# EAGLE design Yun_Shield.v1.1.6 (EAGLE 7.3.0)

## Sheet 1 of 5
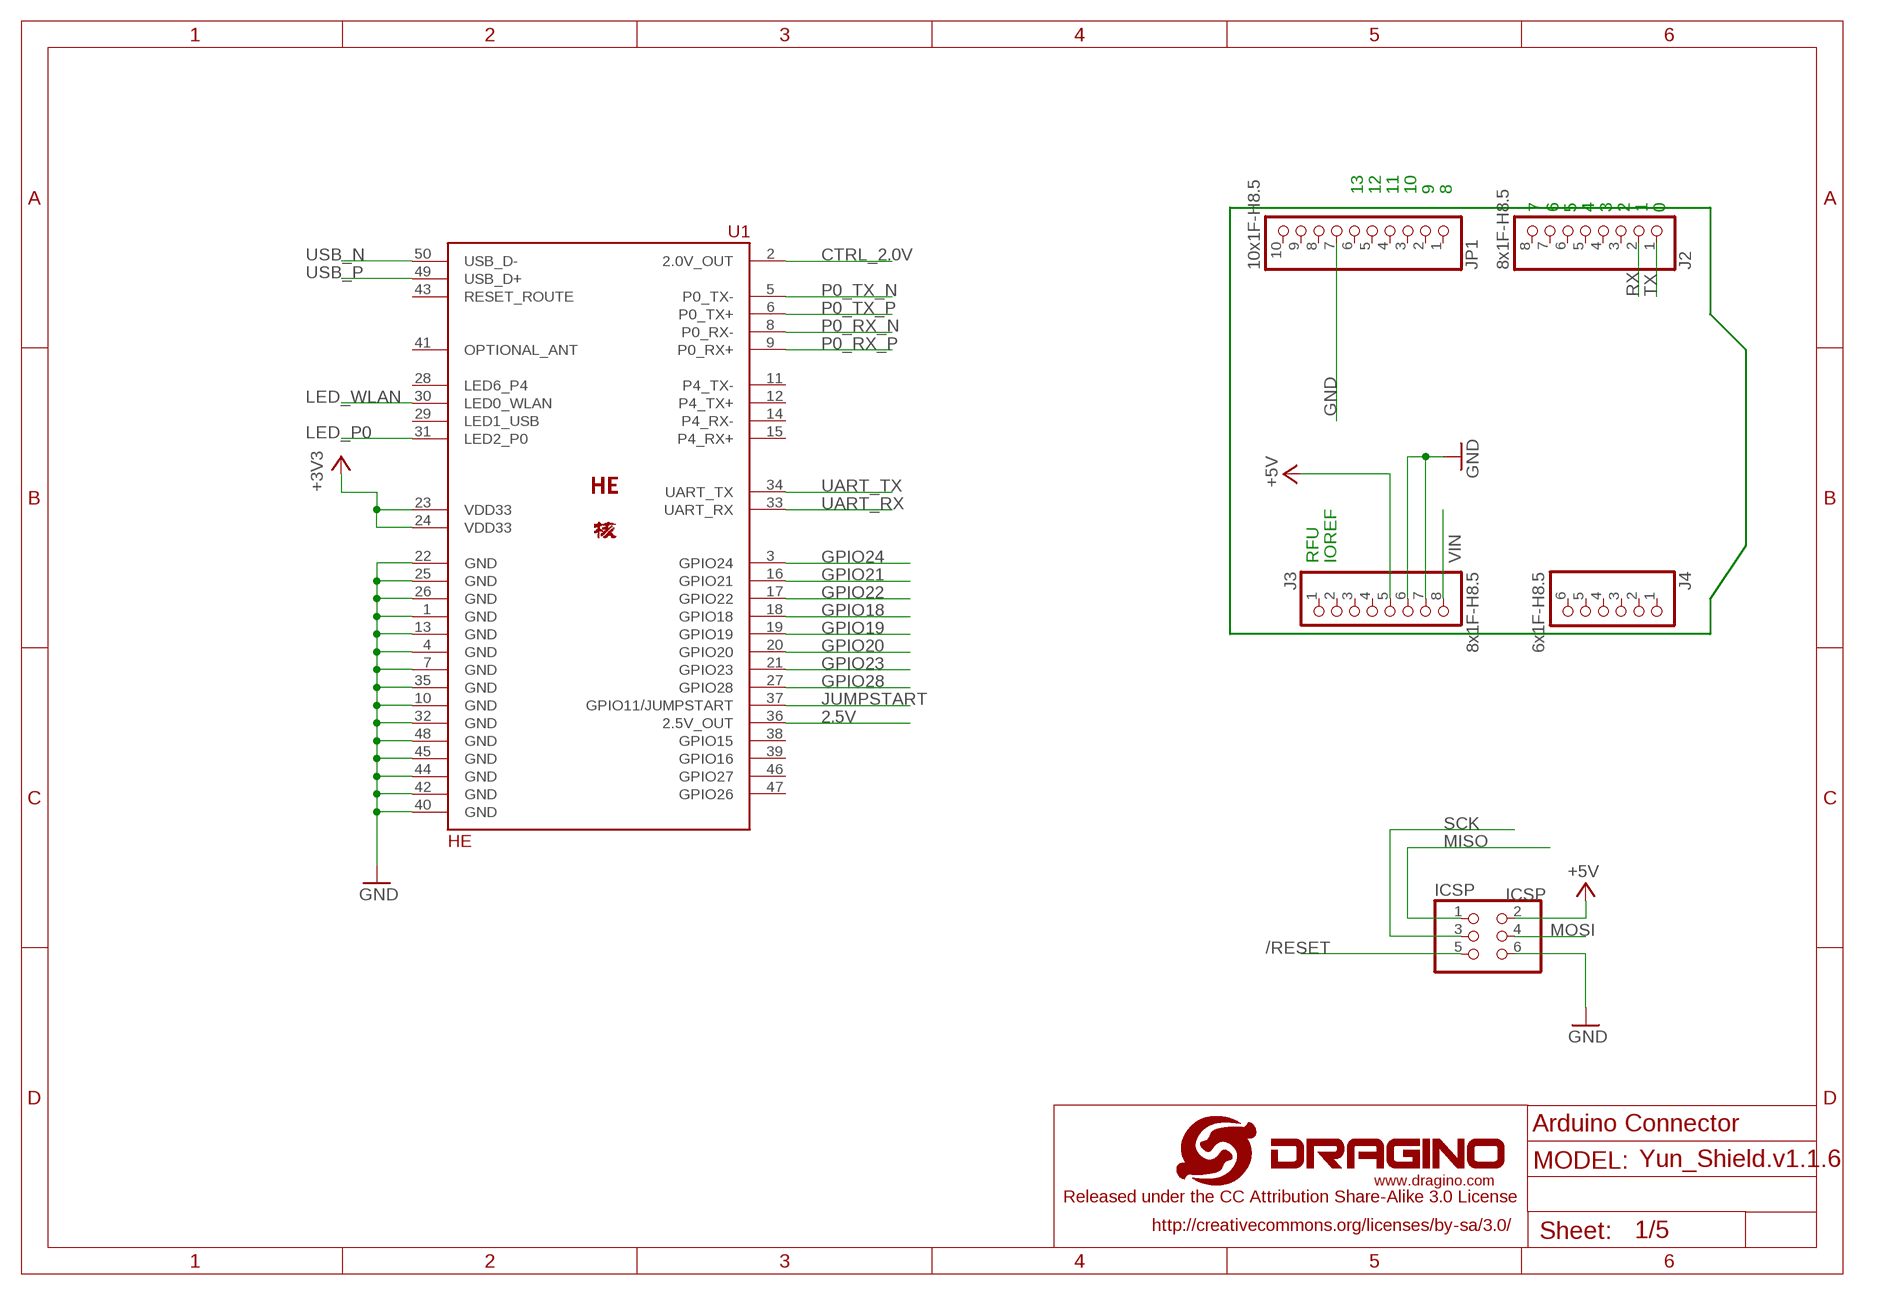
[diagram p0: schematic, sheet 1]

### Parts
ICSP  ICSP  PINHD-2X3  [2X03]
J2  8x1F-H8.5  PINHD-1X8  [1X08]
J3  8x1F-H8.5  PINHD-1X8  [1X08]
J4  6x1F-H8.5  PINHD-1X6  [1X06]
JP1  10x1F-H8.5  PINHD-1X10  [1X10]
U1  HE  [HE50]
U$1  LOGO-NEW  [LOGO-SILK-NEW]

### Nets
2.5V: U1.36(2.5V_OUT)
5V [usbvcc]: ICSP.2 ; supply symbol labelled +5V
+3V3: U1.23(VDD33) U1.24(VDD33) ; also sheet 2,3,4
+5V [usbvcc]: J3.5 ; also sheet 2,4
/RESET: ICSP.5 ; also sheet 3
CTRL_2.0V: U1.2(2.0V_OUT) ; also sheet 5
GND [gnd]: ICSP.6 J3.6 J3.7 JP1.7 U1.1(GND) U1.4(GND) U1.7(GND) U1.10(GND) U1.13(GND) U1.22(GND) U1.25(GND) U1.26(GND) U1.32(GND) U1.35(GND) U1.40(GND) U1.42(GND) U1.44(GND) U1.45(GND) U1.48(GND) ; also sheet 2,3,4,5
GPIO18: U1.18(GPIO18) ; also sheet 3
GPIO19: U1.19(GPIO19) ; also sheet 3
GPIO20: U1.20(GPIO20) ; also sheet 3
GPIO21: U1.16(GPIO21) ; also sheet 3
GPIO22: U1.17(GPIO22) ; also sheet 3
GPIO23: U1.21(GPIO23) ; also sheet 3
GPIO24: U1.3(GPIO24) ; also sheet 3
GPIO28: U1.27(GPIO28) ; also sheet 4
JUMPSTART: U1.37(GPIO11/JUMPSTART) ; also sheet 4
LED_P0: U1.31(LED2_P0) ; also sheet 4
LED_WLAN: U1.30(LED0_WLAN) ; also sheet 4
MISO: ICSP.1 ; also sheet 3
MOSI: ICSP.4 ; also sheet 3
P0_RX_N: U1.8(P0_RX-) ; also sheet 5
P0_RX_P: U1.9(P0_RX+) ; also sheet 5
P0_TX_N: U1.5(P0_TX-) ; also sheet 5
P0_TX_P: U1.6(P0_TX+) ; also sheet 5
RX: J2.2 ; also sheet 3
SCK: ICSP.3 ; also sheet 3
TX: J2.1 ; also sheet 3
UART_RX: U1.33(UART_RX) ; also sheet 3
UART_TX: U1.34(UART_TX) ; also sheet 3
USB_N [usbtrace]: U1.50(USB_D-) ; also sheet 4
USB_P [usbtrace]: U1.49(USB_D+) ; also sheet 4
VIN: J3.8 ; also sheet 2,5
Unconnected: J2.3 J2.4 J2.5 J2.6 J2.7 J2.8 J3.1 J3.2 J3.3 J3.4 J4.1 J4.2 J4.3 J4.4 J4.5 J4.6 JP1.1 JP1.2 JP1.3 JP1.4 JP1.5 JP1.6 JP1.8 JP1.9 JP1.10 U1.11(P4_TX-) U1.12(P4_TX+) U1.14(P4_RX-) U1.15(P4_RX+) U1.28(LED6_P4) U1.29(LED1_USB) U1.38(GPIO15) U1.39(GPIO16) U1.43(RESET_ROUTE) U1.46(GPIO27) U1.47(GPIO26)

### Notes on the sheet
- 13 | 12 | 11 | 10 | 9 | 8
- 7 | 6 | 5 | 4 | 3 | 2 | 1 | 0
- RFU | IOREF
- Arduino Connector

## Sheet 2 of 5
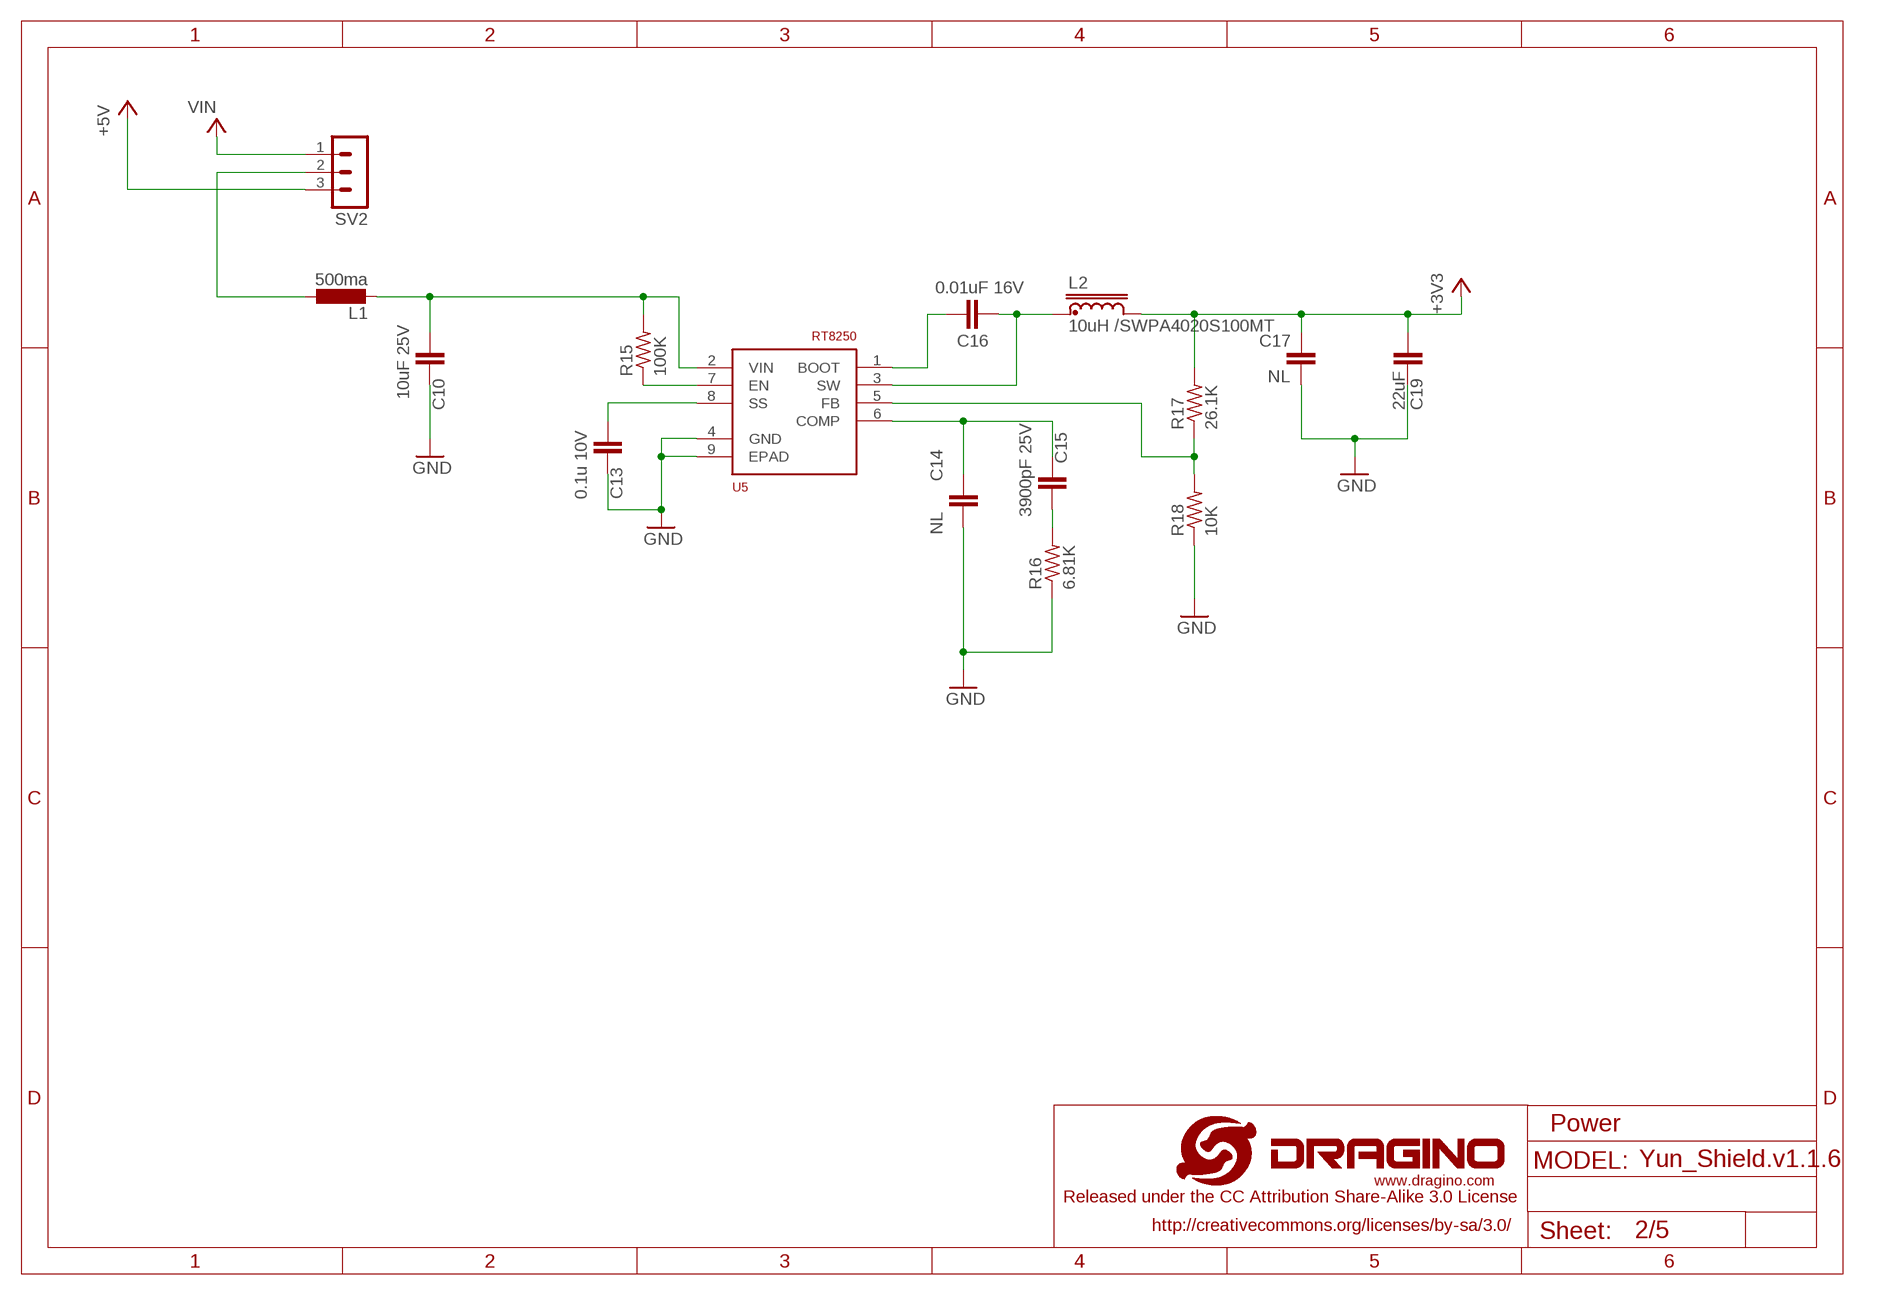
[diagram p1: schematic, sheet 2]

### Parts
C10  10uF 25V  C-EUC1206  [C1206]
C13  0.1u 10V  C-EUC0402  [C0402]
C14  NL  C-EUC0402  [C0402]
C15  3900pF 25V  C-EUC0402  [C0402]
C16  0.01uF 16V  C-EUC0402  [C0402]
C17  NL  C-EUC0402  [C0402]
C19  22uF  C-EUC1210  [C1210]
L1  500ma  L-EUL1812  [L1812]
L2  10uH /SWPA4020S100MT  INDUCTORSWPA4020S  [SWPA4020S]
R15  100K  R-US_R0402  [R0402]
R16  6.81K  R-US_R0402  [R0402]
R17  26.1K  R-US_R0402  [R0402]
R18  10K  R-US_R0402  [R0402]
SV2  MA03-1  [MA03-1]
U5  RT8250  [RT8250-SOP8]

### Nets
+3V3: C17.1 C19.1 L2.P$2 R17.2 ; also sheet 1,3,4
+5V [usbvcc]: SV2.3 ; also sheet 1,4
GND [gnd]: C10.1 C13.2 C14.2 C17.2 C19.2 R16.1 R18.1 U5.4(GND) U5.9(EPAD) ; also sheet 1,3,4,5
N$10: C10.2 L1.2 R15.2 U5.2(VIN)
N$13: R15.1 U5.7(EN)
N$14: R17.1 R18.2 U5.5(FB)
N$15: C13.1 U5.8(SS)
N$17: C14.1 C15.1 U5.6(COMP)
N$18: C15.2 R16.2
N$20: C16.1 U5.1(BOOT)
N$21: C16.2 L2.P$1 U5.3(SW)
VCC: L1.1 SV2.2
VIN: SV2.1 ; also sheet 1,5

### Notes on the sheet
- Power

## Sheet 3 of 5
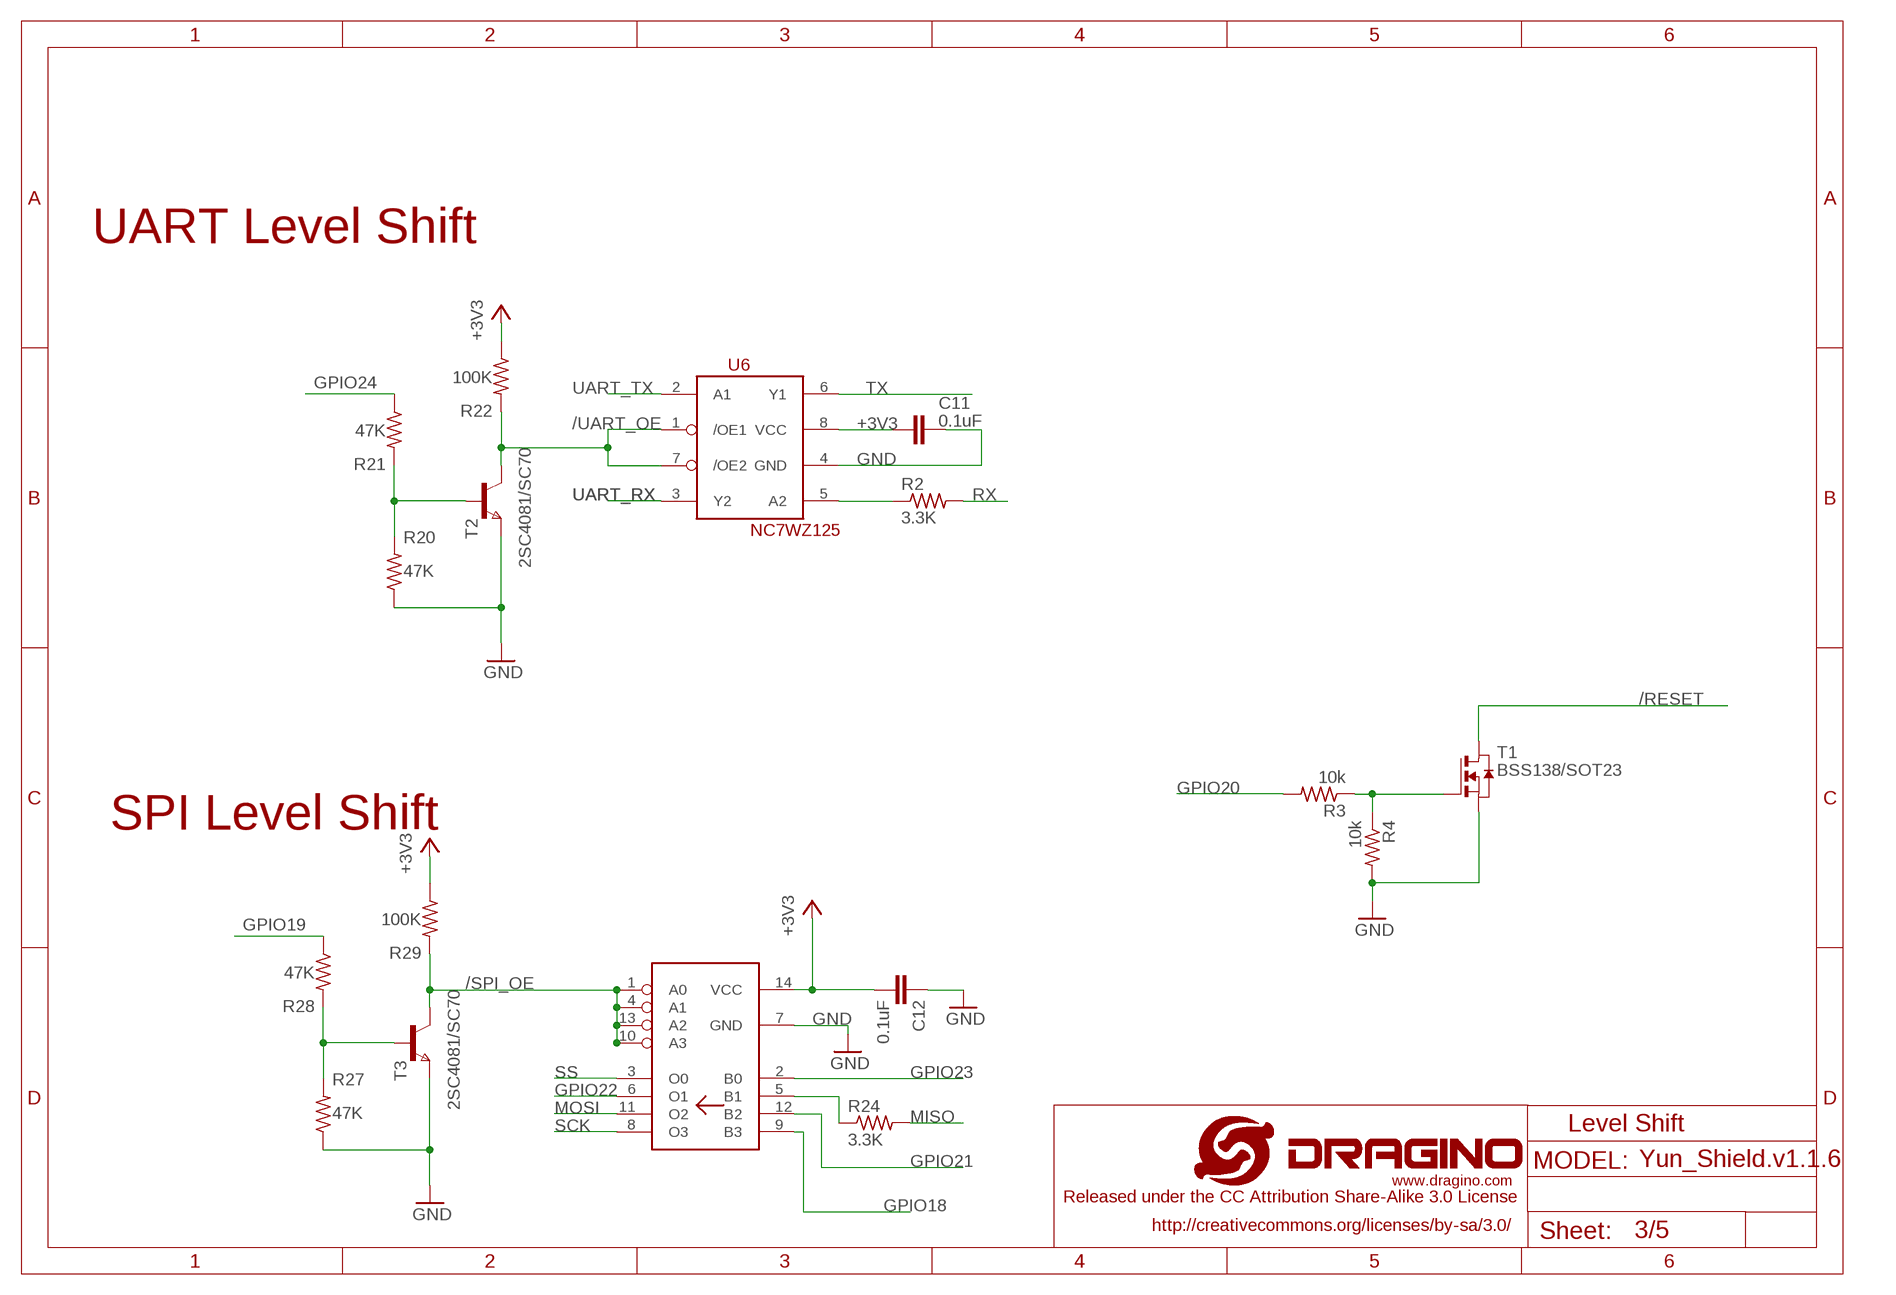
[diagram p2: schematic, sheet 3]

### Parts
C11  0.1uF  C-EUC0402  [C0402]
C12  0.1uF  C-EUC0402  [C0402]
R2  3.3K  R-US_R0402  [R0402]
R3  10k  R-US_R0402  [R0402]
R4  10k  R-US_R0402  [R0402]
R20  47K  R-US_R0402  [R0402]
R21  47K  R-US_R0402  [R0402]
R22  100K  R-US_R0402  [R0402]
R24  3.3K  R-US_R0402  [R0402]
R27  47K  R-US_R0402  [R0402]
R28  47K  R-US_R0402  [R0402]
R29  100K  R-US_R0402  [R0402]
T1  BSS138/SOT23  NMOSFET-SOT23  [SOT-23]
T2  2SC4081/SC70  NPNSOT323  [SOT323]
T3  2SC4081/SC70  NPNSOT323  [SOT323]
U6  NC7WZ125  [US8]
U7  74VHC125  [74VHC125]

### Nets
+3V3: C11.2 C12.2 R22.1 R29.1 U6.8(VCC) U7.14(VCC) ; also sheet 1,2,4
/RESET: T1.1(D) ; also sheet 1
/SPI_OE: R29.2 T3.1(C) U7.1(A0) U7.4(A1) U7.10(A3) U7.13(A2)
/UART_OE: R22.2 T2.1(C) U6.1(/OE1) U6.7(/OE2)
GND [gnd]: C11.1 C12.1 R4.2 R20.1 R27.1 T1.2(S) T2.3(E) T3.3(E) U6.4(GND) U7.7(GND) ; also sheet 1,2,4,5
GPIO18: U7.9(B3) ; also sheet 1
GPIO19: R28.1 ; also sheet 1
GPIO20: R3.2 ; also sheet 1
GPIO21: U7.12(B2) ; also sheet 1
GPIO22: U7.6(O1) ; also sheet 1
GPIO23: U7.2(B0) ; also sheet 1
GPIO24: R21.1 ; also sheet 1
MISO: R24.2 ; also sheet 1
MOSI: U7.11(O2) ; also sheet 1
N$1: R3.1 R4.1 T1.3(G)
N$11: R20.2 R21.2 T2.2(B)
N$12: R27.2 R28.2 T3.2(B)
N$16: R2.1 U6.5(A2)
N$19: R24.1 U7.5(B1)
RX: R2.2 ; also sheet 1
SCK: U7.8(O3) ; also sheet 1
SS: U7.3(O0)
TX: U6.6(Y1) ; also sheet 1
UART_RX: U6.3(Y2) ; also sheet 1
UART_TX: U6.2(A1) ; also sheet 1

### Notes on the sheet
- UART Level Shift
- SPI Level Shift
- Level Shift

## Sheet 4 of 5
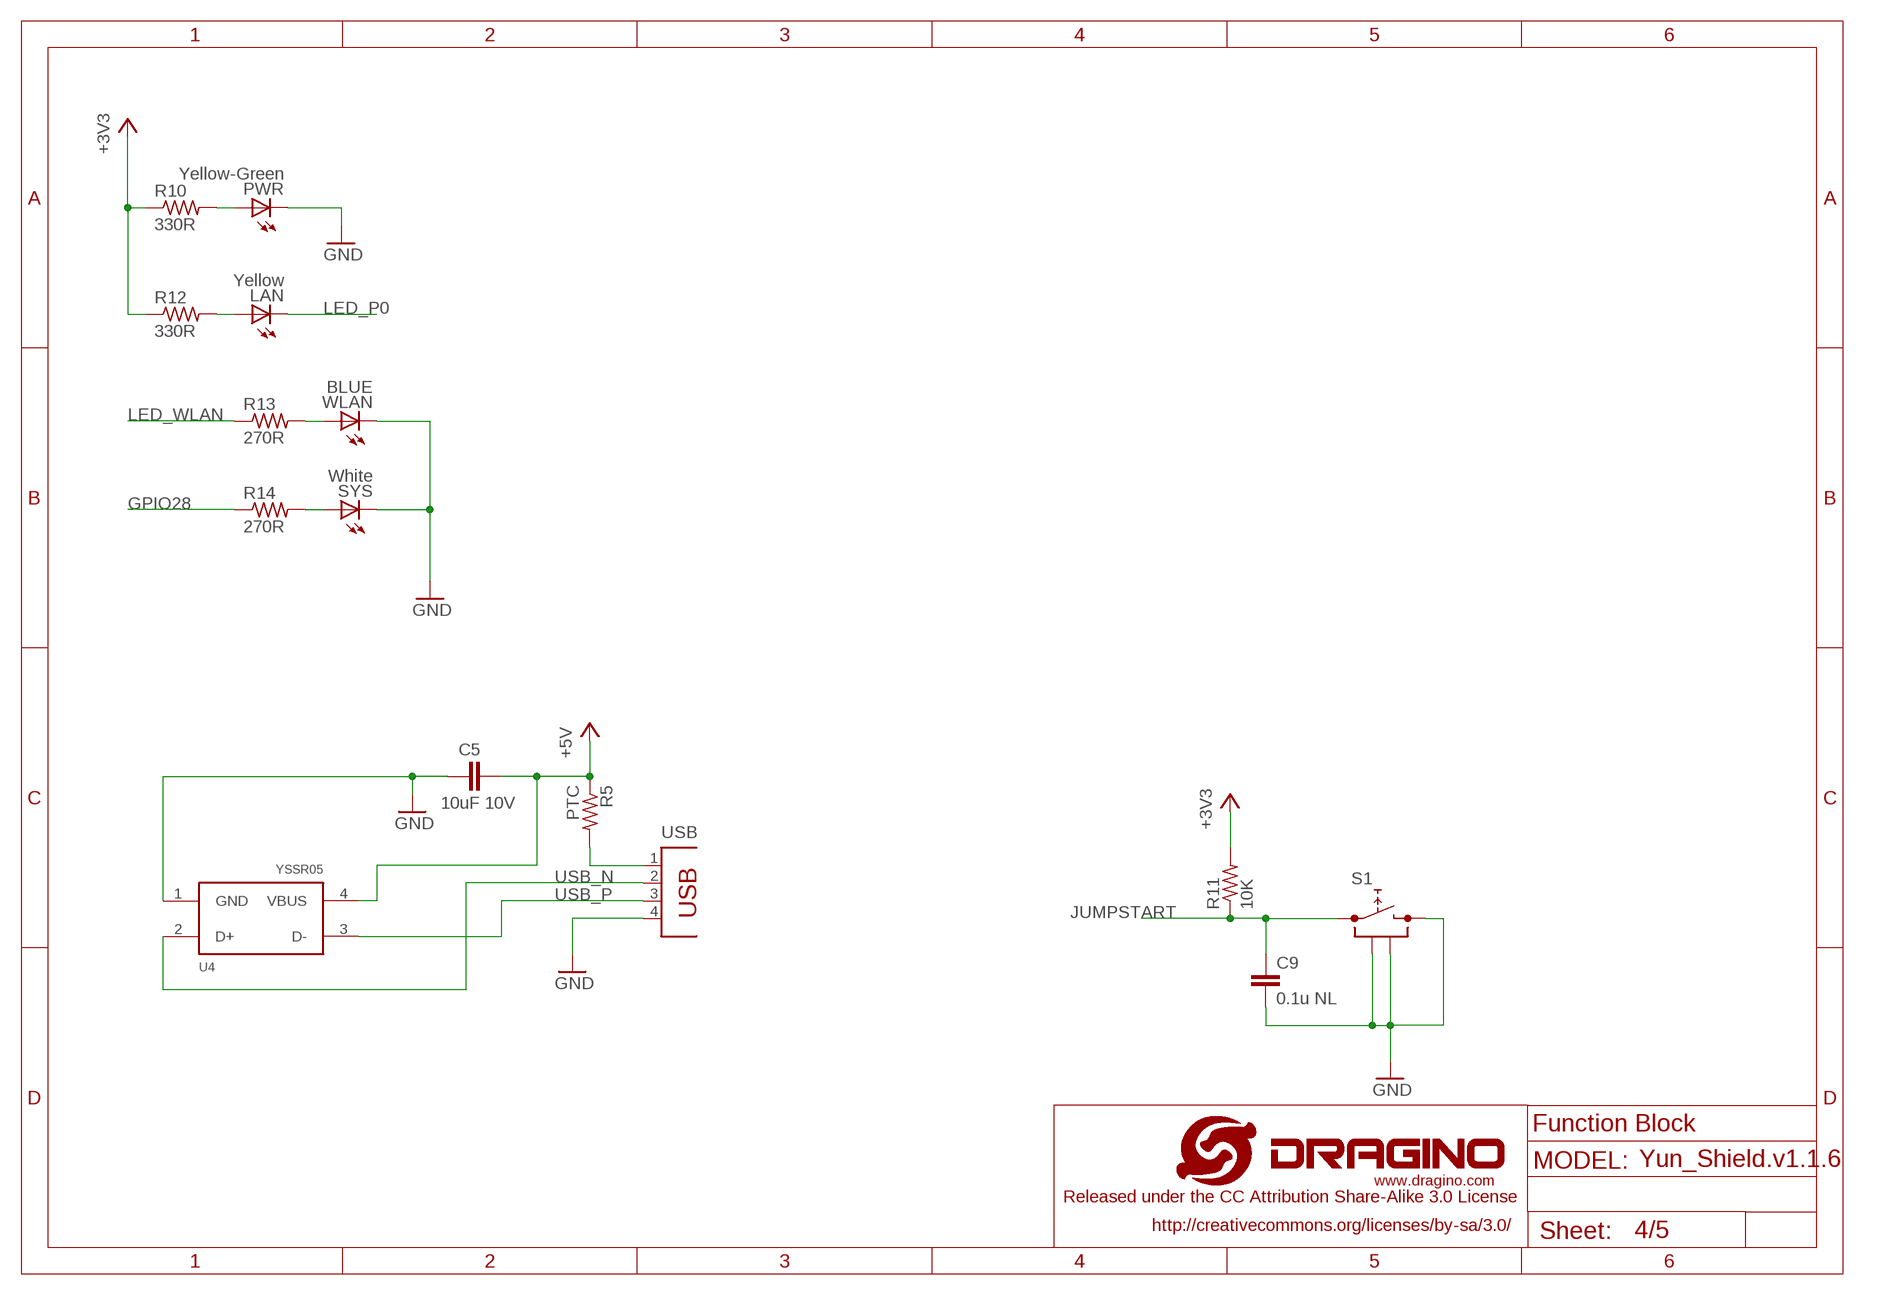
[diagram p3: schematic, sheet 4]

### Parts
C5  10uF 10V  C-EUC0805  [C0805]
C9  0.1u NL  C-EUC0402  [C0402]
LAN  Yellow  LEDCHIP-LED0603  [CHIP-LED0603]
PWR  Yellow-Green  LEDCHIP-LED0603  [CHIP-LED0603]
R5  PTC  R-US_R0805  [R0805]
R10  330R  R-US_R0402  [R0402]
R11  10K  R-US_R0402  [R0402]
R12  330R  R-US_R0402  [R0402]
R13  270R  R-US_R0402  [R0402]
R14  270R  R-US_R0402  [R0402]
S1  PUSH_SWITCH  [SWITCH_6X6X5]
SYS  White  LEDCHIP-LED0603  [CHIP-LED0603]
U4  YSSR05  [SOT143]
USB  PN87520  [PN87520]
WLAN  BLUE  LEDCHIP-LED0603  [CHIP-LED0603]

### Nets
+3V3: R10.1 R11.2 R12.1 ; also sheet 1,2,3
+5V [usbvcc]: C5.1 R5.1 U4.4(VBUS) ; also sheet 1,2
GND [gnd]: C5.2 C9.2 PWR.C S1.2 S1.3 S1.4 SYS.C U4.1(GND) USB.4 WLAN.C ; also sheet 1,2,3,5
GPIO28: R14.1 ; also sheet 1
JUMPSTART: C9.1 R11.1 S1.1 ; also sheet 1
LED_P0: LAN.C ; also sheet 1
LED_WLAN: R13.1 ; also sheet 1
N$2: R5.2 USB.1
N$4: PWR.A R10.2
N$6: LAN.A R12.2
N$8: R13.2 WLAN.A
N$9: R14.2 SYS.A
USB_N [usbtrace]: U4.2(D+) USB.2 ; also sheet 1
USB_P [usbtrace]: U4.3(D-) USB.3 ; also sheet 1

### Notes on the sheet
- Function Block

## Sheet 5 of 5
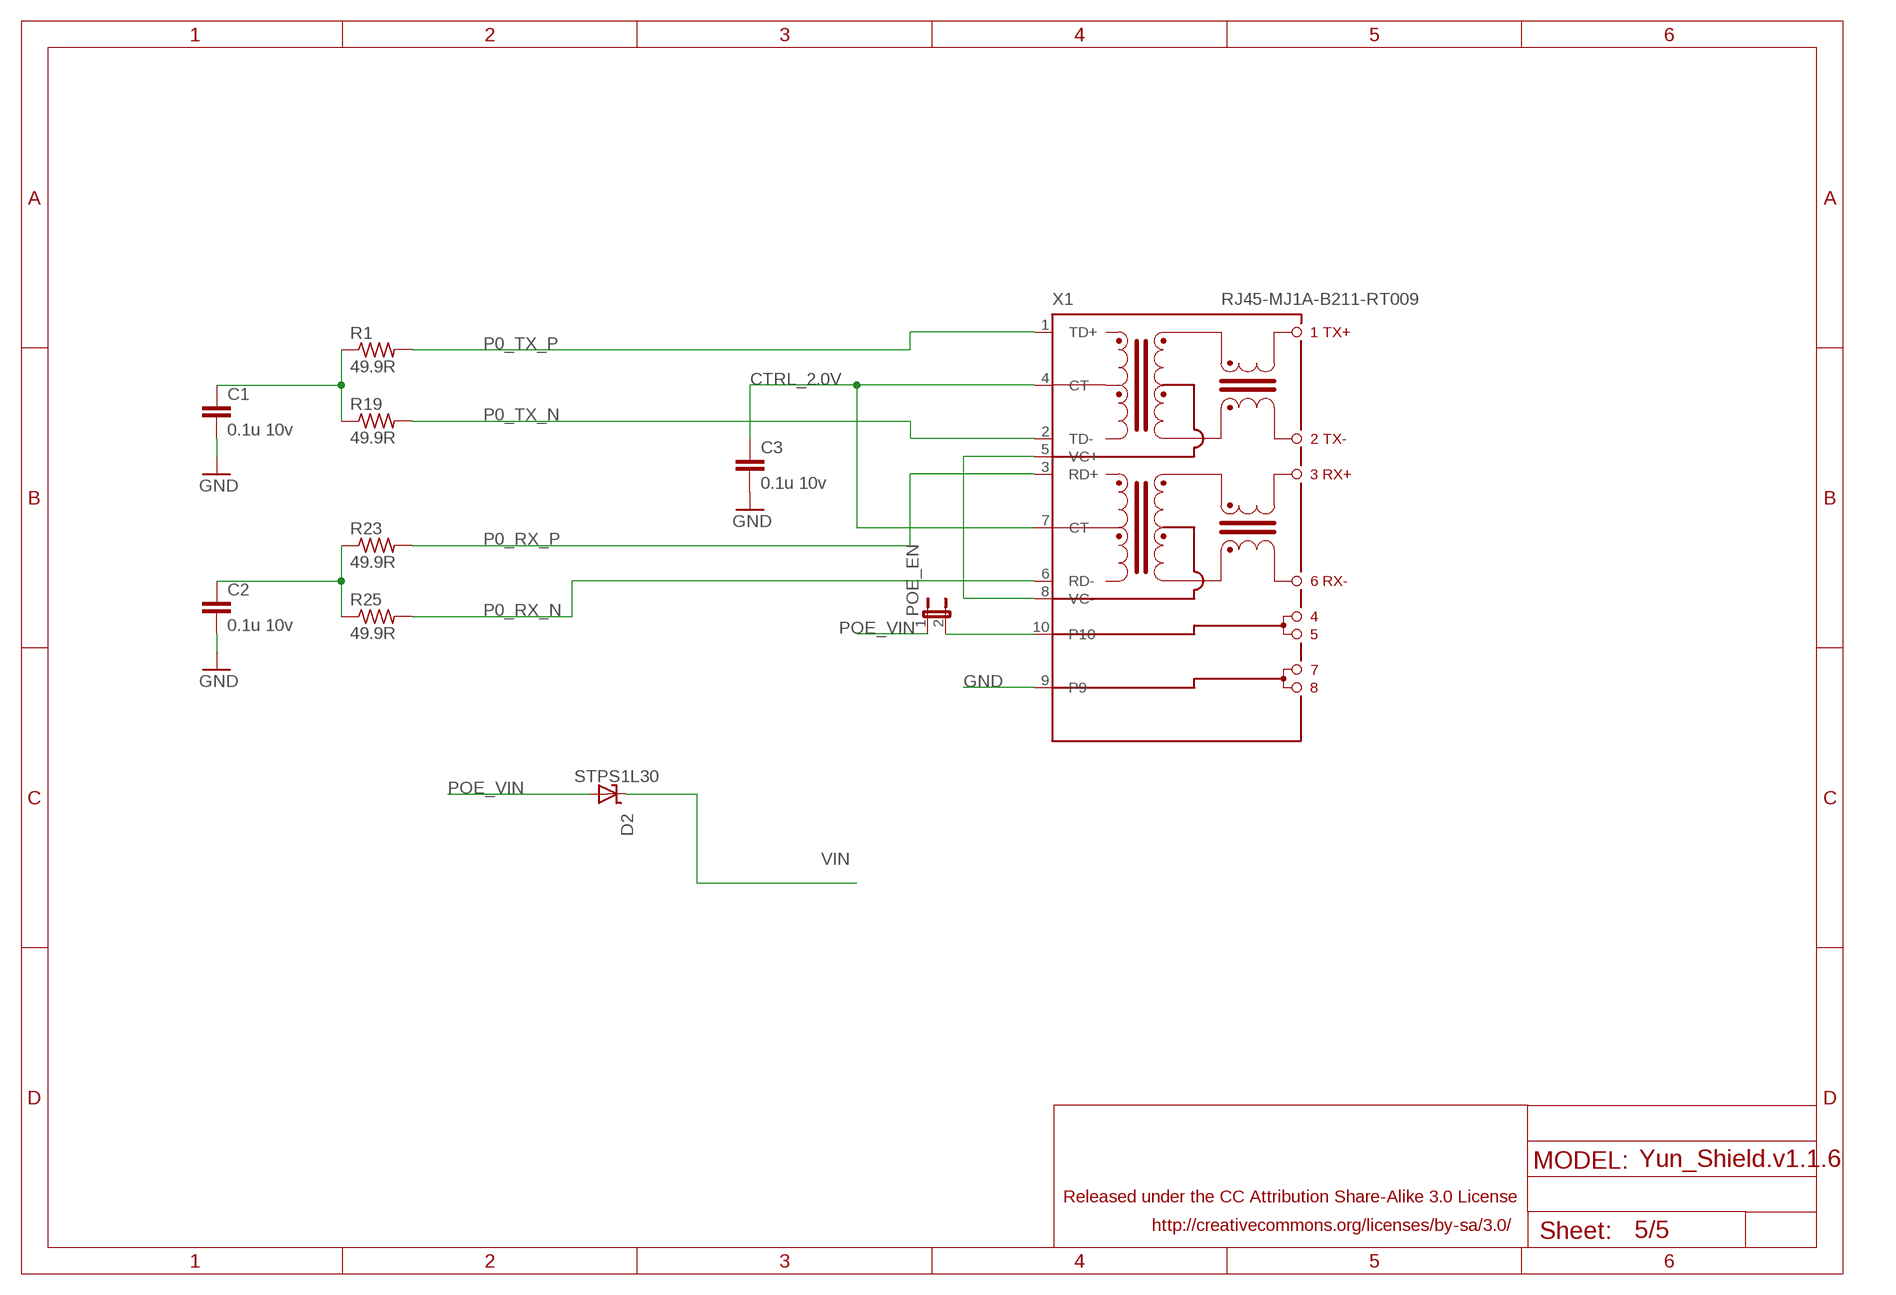
[diagram p4: schematic, sheet 5]

### Parts
C1  0.1u 10v  C-EUC0402  [C0402]
C2  0.1u 10v  C-EUC0402  [C0402]
C3  0.1u 10v  C-EUC0402  [C0402]
D2  STPS1L30  SCHOTTKYSMBG  [DO214AC]
POE_EN  JP1E  [JP1]
R1  49.9R  R-US_R0402  [R0402]
R19  49.9R  R-US_R0402  [R0402]
R23  49.9R  R-US_R0402  [R0402]
R25  49.9R  R-US_R0402  [R0402]
X1  RJ45-MJ1A-B211-RT009  [MJ1A-B211-RT009]

### Nets
CTRL_2.0V: C3.1 X1.4(CT) X1.7(CT) ; also sheet 1
GND [gnd]: C1.2 C2.2 C3.2 X1.9 ; also sheet 1,2,3,4
N$3: POE_EN.2 X1.10
N$25: X1.5(VC+) X1.8(VC-)
N$32: C1.1 R1.1 R19.1
N$33: C2.1 R23.1 R25.1
P0_RX_N: R25.2 X1.6(RD-) ; also sheet 1
P0_RX_P: R23.2 X1.3(RD+) ; also sheet 1
P0_TX_N: R19.2 X1.2(TD-) ; also sheet 1
P0_TX_P: R1.2 X1.1(TD+) ; also sheet 1
POE_VIN: D2.A POE_EN.1
VIN: D2.C ; also sheet 1,2

## Power pins joined to a net without a drawn wire
OPTIONAL_ANT: U1.41(OPTIONAL_ANT)

## Library data of the parts
C1-C3 C5 C9-C17 C19 = dragino:C-EU: CAPACITOR, European symbol
D2 = dragino:SCHOTTKY: Suppressor diode
ICSP = SmartPrj:PINHD-2X3: PIN HEADER
J2 J3 = SmartPrj:PINHD-1X8: PIN HEADER
J4 = SmartPrj:PINHD-1X6: PIN HEADER
JP1 = SmartPrj:PINHD-1X10: PIN HEADER
L1 = dragino:L-EU: INDUCTOR, European symbol
L2 = dragino:INDUCTOR: CHOKE U15
LAN PWR SYS WLAN = dragino:LED: LED OSRAM: - CHIPLED LG R971, LG N971, LY N971, LG Q971, LY Q971, LO R971, LY R971 LH N974, LH R974 LS Q976, LO Q976, LY Q976 LO Q996 - Hyper CHIPLED LW Q18S LB Q993, LB Q99A, LB R99A - SideLED LS A670, LO A670, LY A670, LG A670, LP A670 LB A673, LV A673, LT A673, LW A673 LH A674 LY A675 LS A676, LA A676, LO A676, LY A676, LW A676 LS A679, LY A679, LG A679 - Hyper Micro SIDELED® LS Y876, LA Y876, LO Y876, LY Y876 LT Y87S - SmartLED LW L88C, LW L88S LB L89C, LB L89S, LG L890 LS L89K, LO L89K, LY L89K LS L896, LA L896, LO L896, LY L896 - TOPLED LS T670, LO T670, LY T670, LG T670, LP T670 LSG T670, LSP T670, LSY T670, LOP T670, LYG T670 LG T671, LOG T671, LSG T671 LB T673, LV T673, LT T673, LW T673 LH T674 LS T676, LA T676, LO T676, LY T676, LB T676, LH T676, LSB T676, LW T676 LB T67C, LV T67C, LT T67C, LS T67K, LO T67K, LY T67K, LW E67C LS E67B, LA E67B, LO E67B, LY E67B, LB E67C, LV E67C, LT E67C LW T67C LS T679, LY T679, LG T679 LS T770, LO T770, LY T770, LG T770, LP T770 LB T773, LV T773, LT T773, LW T773 LH T774 LS E675, LA E675, LY E675, LS T675 LS T776, LA T776, LO T776, LY T776, LB T776 LHGB T686 LT T68C, LB T68C - Hyper Mini TOPLED® LB M676 - Mini TOPLED Santana® LG M470 LS M47K, LO M47K, LY M47K Source: http://www.osram.convergy.de LUXEON: - LUMILED® LXK2-PW12-R00, LXK2-PW12-S00, LXK2-PW14-U00, LXK2-PW14-V00 LXK2-PM12-R00, LXK2-PM12-S00, LXK2-PM14-U00 LXK2-PE12-Q00, LXK2-PE12-R00, LXK2-PE12-S00, LXK2-PE14-T00, LXK2-PE14-U00 LXK2-PB12-K00, LXK2-PB12-L00, LXK2-PB12-M00, LXK2-PB14-N00, LXK2-PB14-P00, LXK2-PB14-Q00 LXK2-PR12-L00, LXK2-PR12-M00, LXK2-PR14-Q00, LXK2-PR14-R00 LXK2-PD12-Q00, LXK2-PD12-R00, LXK2-PD12-S00 LXK2-PH12-R00, LXK2-PH12-S00 LXK2-PL12-P00, LXK2-PL12-Q00, LXK2-PL12-R00 Source: www.luxeon.com KINGBRIGHT: KA-3528ASYC Source: www.kingbright.com
POE_EN = dragino:JP1E: JUMPER
R1-R5 R10-R25 R27-R29 = dragino:R-US_: RESISTOR, American symbol
S1 = dragino:PUSH_SWITCH: PUSH SWITCH ITT-Cannon-Cannon
SV2 = con-lstb:MA03-1: PIN HEADER; OC_FARNELL: unknown; OC_NEWARK: unknown
T1 = dragino:NMOSFET-SOT23: MOS FET; OC_FARNELL: unknown; OC_NEWARK: unknown
T2 T3 = zetex:NPNSOT323: NPN TRANSISTOR; MPN: DSS4160U-7; OC_FARNELL: 1710696; OC_NEWARK: 25R4558
U1 = dragino:HE
U4 = dragino:YSSR05: Yeashin LOW CAPACITANCE TVS DIODE ARRAY http://www.yeashin.tw/download.php?id=4588
U5 = dragino:RT8250: DC-DC Converter. http://www.richtek.com/download.jsp?t=UyUyRmFzc2V0cyUyRnByb2R1Y3RfZmlsZSUyRlJUODI1MCUyRkRTODI1MC0wNS5wZGYlM0QlM0Ql%0AM0REUzgyNTAtMDVD
U6 = dragino:NC7WZ125: 3 state buffer: http://www.fairchildsemi.com/ds/NC/NC7WZ125.pdf
U7 = dragino:74VHC125
U$1 = dragino:LOGO-NEW
USB = con-berg:PN87520: BERG USB connector; OC_FARNELL: unknown; OC_NEWARK: unknown
X1 = dragino-passive:RJ45-MJ1A-B211-RT009

## Net classes
1 power: width 0.254 mm, drill 0.61 mm, clearance 0.254 mm
2 gnd: width 0.305 mm, drill 0.33 mm, clearance 0.254 mm
3 usbvcc: width 0.254 mm, drill 0.61 mm, clearance 0.254 mm
4 aref: width 0.254 mm, drill 0.61 mm, clearance 0.254 mm
5 usbtrace: width 0.254 mm, clearance 0.152 mm

## Board
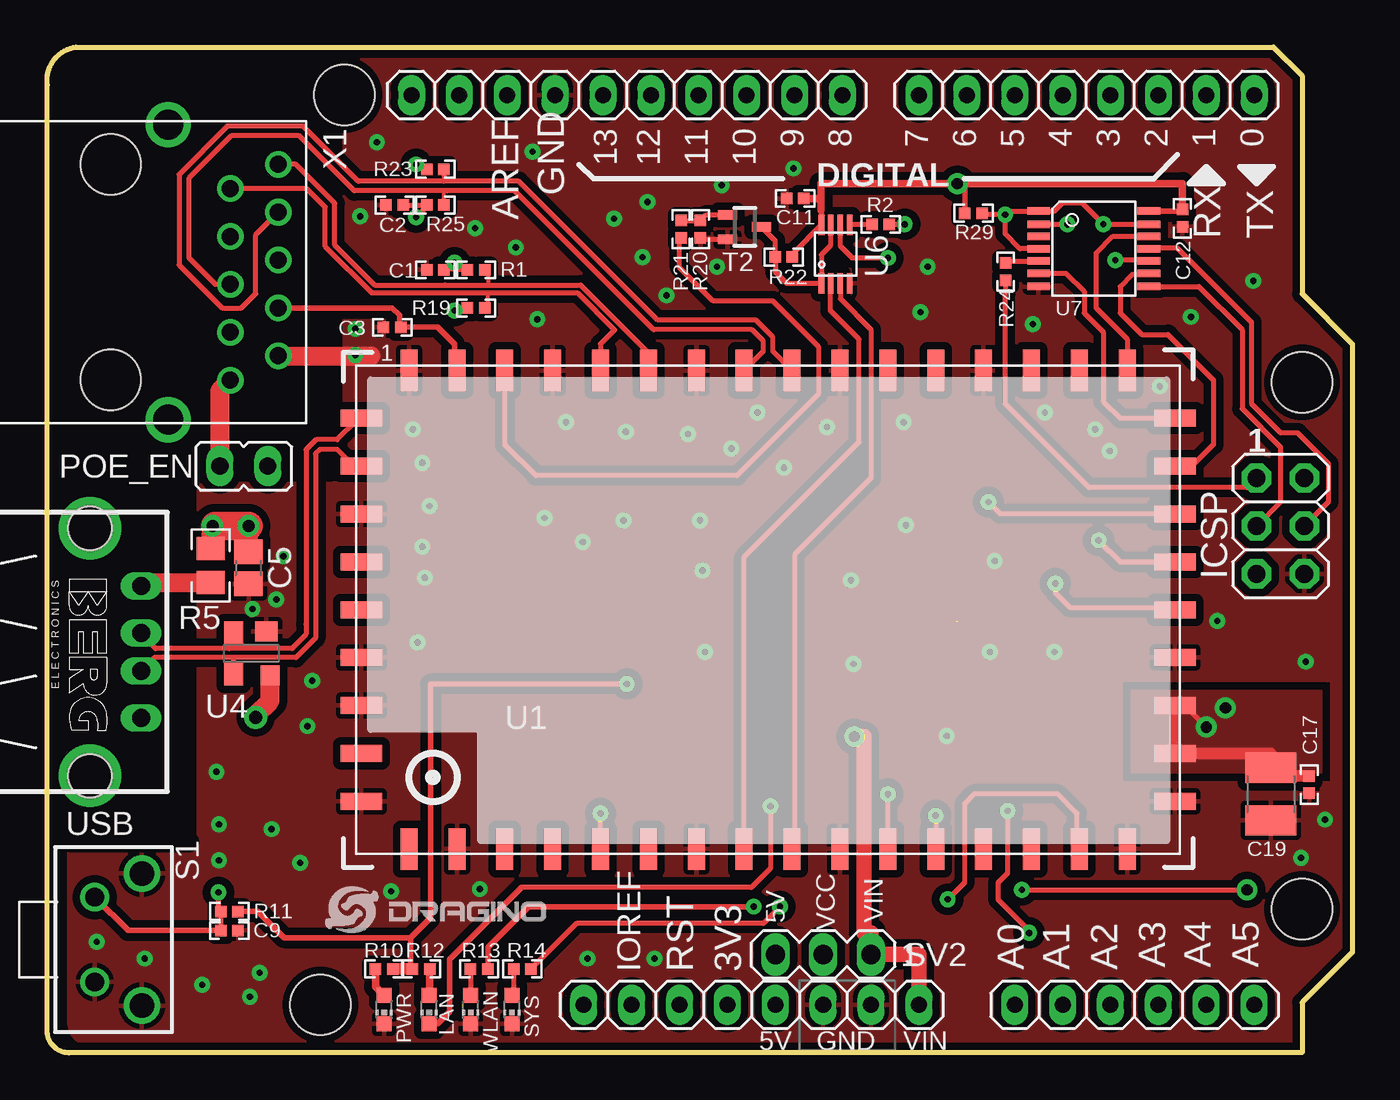
[diagram p5: board, top side]
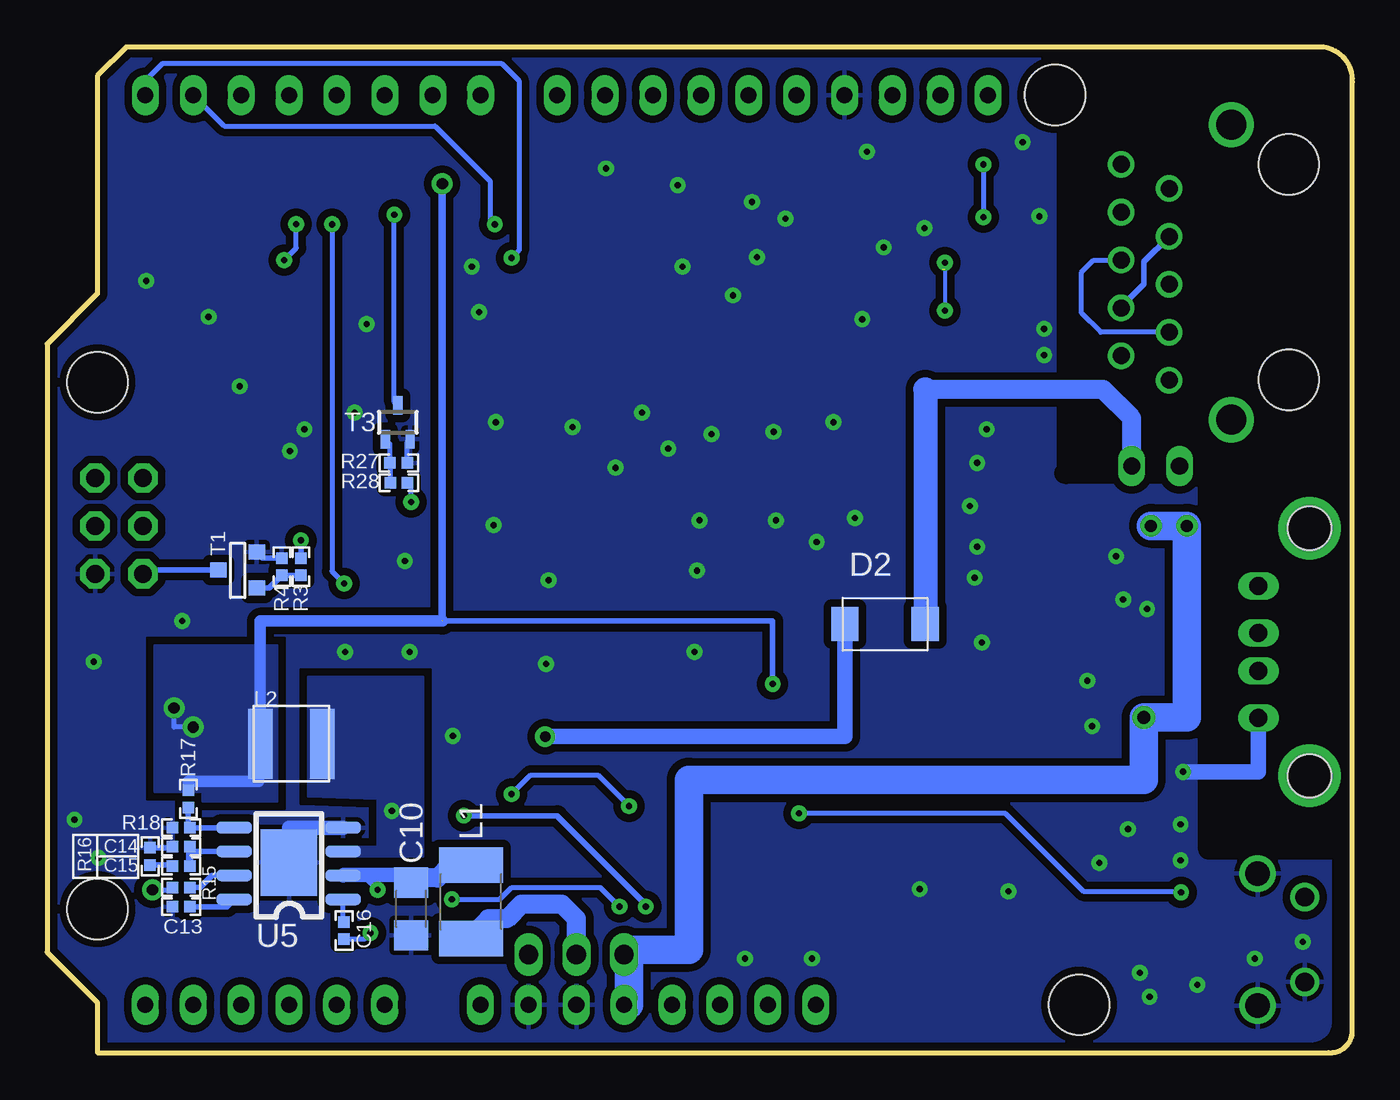
[diagram p6: board, bottom side, seen from below]

Size 69.23 x 53.35 mm. Coordinates in mm from the lower left corner, seen from the top.
Outline: 65.04,53.35 66.56,51.82 66.56,40.27 69.23,37.6 69.23,5.34 66.56,2.67 66.56,0.01 1.27,0.01 arc-90 0.02,1.02 0.02,51.35 arc-90 1.52,53.35 65.04,53.35
Copper layers (1*16): Top 0.035mm / dielectric 1.5mm / Bottom 0.035mm
Design rules "default *": minimum track width 8mil, minimum drill 13mil, track to track 6mil, track to pad 6mil, pad to pad 6mil, via to via 6mil, smd to smd 6mil, copper to edge 12mil, drill to drill 8mil, minimum pad ring 10mil, minimum via ring 10mil, stop-mask expansion 2mil, vias tented up to drill 20mil, thermal gap 10mil
Holes 3.2 mm at 66.56,35.57 66.56,7.63 15.76,50.81 14.49,2.55
tRestrict: area 1.2,11.2 to 15.1,52.6
bRestrict: area 1.2,10.8 to 15.3,52.6
vRestrict: area 43.1,38.6 to 43.6,38.9; area 36.3,35.2 to 37,35.7; area 45,35.2 to 45.7,35.7; area 41.8,35.2 to 42.3,35.7; area 48.4,10.3 to 49,10.8; area 50.9,10.2 to 51.5,11.1

### Footprints (pad centres in the part's own frame; a part is rotated, then mirrored left to right if it is on the bottom)
C0402 = smd 0.61 x 0.61: 1 -0.457,0; 2 0.457,0
C0805 = smd 1.3 x 1.5: 1 -0.85,0; 2 0.85,0
C1206 = smd 1.6 x 1.8: 1 -1.4,0; 2 1.4,0
C1210 = smd 1.6 x 2.7: 1 -1.4,0; 2 1.4,0
DO214AC = smd 1.45 x 1.8: A 2.13,0; C -2.13,0
2X03 = drill 0.95 pad 1.55 octagon: 1 -2.54,-1.27; 2 -2.54,1.27; 3 0,-1.27; 4 0,1.27; 5 2.54,-1.27; 6 2.54,1.27
1X08 = drill 0.85 pad 1.422 long: 1 -8.89,0; 2 -6.35,0; 3 -3.81,0; 4 -1.27,0; 5 1.27,0; 6 3.81,0; 7 6.35,0; 8 8.89,0
1X06 = drill 0.85 pad 1.422 long: 1 -6.35,0; 2 -3.81,0; 3 -1.27,0; 4 1.27,0; 5 3.81,0; 6 6.35,0
1X10 = drill 0.85 pad 1.422 long: 1 -11.43,0; 2 -8.89,0; 3 -6.35,0; 4 -3.81,0; 5 -1.27,0; 6 1.27,0; 7 3.81,0; 8 6.35,0; 9 8.89,0; 10 11.43,0
L1812 = smd 1.9 x 3.4: 1 -1.95,0; 2 1.95,0
SWPA4020S = smd 3.7 x 1.3: P$1 0,1.65; P$2 0,-1.65
CHIP-LED0603 = smd 0.8 x 0.8: A 0,-0.75; C 0,0.75
JP1 = drill 0.914 long: 1 0,-1.27; 2 0,1.27
R0402 = smd 0.61 x 0.61: 1 -0.457,0; 2 0.457,0
R0805 = smd 1.2 x 1.5: 1 -0.9,0; 2 0.9,0
SWITCH_6X6X5 = drill 0.991 pad 1.524: 1 -2.25,0; 2 2.25,0 | drill 1.295 pad 1.905: 3 3.5,2.5; 4 -3.5,2.5
MA03-1 = drill 1.016 long: 1 -2.54,0; 2 0,0; 3 2.54,0
SOT-23 = smd 0.787 x 0.889: 1 0,-1.016; 2 -0.95,1.016; 3 0.95,1.016
SOT323 = smd 0.5 x 1: 1 0,0.9; 2 -0.65,-0.9; 3 0.65,-0.9
HE50 = smd 0.9 x 2.198: 1 -19.05,12.69; 2 -16.51,12.69; 3 -13.97,12.69; 4 -11.43,12.69; 5 -8.89,12.69; 6 -6.35,12.69; 7 -3.81,12.69; 8 -1.27,12.69; 9 1.27,12.69; 10 3.81,12.69; 11 6.35,12.69; 12 8.89,12.69; 13 11.43,12.69; 14 13.97,12.69; 15 16.51,12.69; 16 19.05,12.69; 26 19.05,-12.69; 27 16.51,-12.69; 28 13.97,-12.69; 29 11.43,-12.69; 30 8.89,-12.69; 31 6.35,-12.69; 32 3.81,-12.69; 33 1.27,-12.69; 34 -1.27,-12.69; 35 -3.81,-12.69; 36 -6.35,-12.69; 37 -8.89,-12.69; 38 -11.43,-12.69; 39 -13.97,-12.69; 40 -16.51,-12.69; 41 -19.05,-12.69 | smd 2.198 x 0.9: 17 21.579,10.16; 18 21.579,7.62; 19 21.579,5.08; 20 21.579,2.54; 21 21.579,0; 22 21.579,-2.54; 23 21.579,-5.08; 24 21.579,-7.62; 25 21.579,-10.16; 42 -21.579,-10.16; 43 -21.579,-7.62; 44 -21.579,-5.08; 45 -21.579,-2.54; 46 -21.579,0; 47 -21.579,2.54; 48 -21.579,5.08; 49 -21.579,7.62; 50 -21.579,10.16
SOT143 = smd 1.194 x 1.067: 1 -0.72,-1.207 | smd 0.991 x 1.194: 2 1.007,-1.143; 3 1.007,1.067 | smd 0.991 x 1.067: 4 -0.923,1.13
RT8250-SOP8 = smd 1.88 x 0.61: 1 -1.219,0; 2 -1.219,-1.27; 3 -1.219,-2.54; 4 -1.219,-3.81; 5 4.547,-3.81; 6 4.547,-2.54; 7 4.547,-1.27; 8 4.547,0 | smd 2.997 x 3.505: 9 1.651,-1.956
US8 = smd 0.3 x 1.1: 1 -0.75,-1.55; 2 -0.25,-1.55; 3 0.25,-1.55; 4 0.75,-1.55; 5 0.75,1.55; 6 0.25,1.55; 7 -0.25,1.55; 8 -0.75,1.55
74VHC125 = smd 0.4 x 1.2: 1 -2.13,-2.88; 2 -1.43,-2.88; 3 -0.78,-2.88; 4 -0.13,-2.88; 5 0.52,-2.88; 6 1.17,-2.88; 7 1.87,-2.88; 8 1.87,2.97; 9 1.17,2.97; 10 0.52,2.97; 11 -0.13,2.97; 12 -0.78,2.97; 13 -1.43,2.97; 14 -2.13,2.97
PN87520 = drill 0.95 long: 1 -3.5,2.71; 2 -1,2.71; 3 1,2.71; 4 3.5,2.71 | drill 2.3: P$1 -6.57,0; P$2 6.57,0 | hole 2.3: -6.57,0; 6.57,0
MJ1A-B211-RT009 = drill 0.9: 1 -5.725,9.07; 2 -4.435,6.53; 3 -3.185,9.07; 4 -1.895,6.53; 5 -0.645,9.07; 6 0.645,6.53; 7 1.895,9.07; 8 3.185,6.53; 9 4.435,9.07; 10 5.725,6.53 | drill 1.6: M1 -7.825,3.23; M2 7.825,3.23 | hole 3.2: -5.715,0.18; 5.715,0.18

### Placement (x,y rotation side)
C1  20.59,41.54 180 top
C2  18.43,44.96 180 top
C3  18.3,38.49 180 top
C5  10.68,25.72 270 top
C9  9.67,6.48 0 top
C10  49.93,7.63 90 bottom
C11  39.67,45.32 0 top
C12  60.22,44.27 90 top
C13  62.12,7.75 180 bottom
C14  62.12,10.93 180 bottom
C15  62.12,9.91 180 bottom
C16  53.48,6.48 270 bottom
C17  66.94,14.23 270 top
C19  64.91,13.72 270 top
D2  24.78,22.74 0 bottom
ICSP  65.42,27.95 270 top
J2  55.13,50.81 180 top
J3  37.35,2.55 0 top
J4  57.67,2.55 0 top
JP1  30.75,50.81 180 top
L1  46.75,8.01 90 bottom
L2  56.28,16.39 270 bottom
LAN  20.26,2.29 180 top
POE_EN  10.43,31.12 90 top
PWR  17.87,2.29 180 top
R1  22.75,41.54 0 top
R2  44.21,43.95 0 top
R3  55.77,25.79 90 bottom
R4  56.78,25.79 90 bottom
R5  8.68,25.85 270 top
R10  17.87,4.45 180 top
R11  9.67,7.5 0 top
R12  19.84,4.45 0 top
R13  22.91,4.45 180 top
R14  25.2,4.45 180 top
R15  62.12,8.77 180 bottom
R16  63.77,10.42 270 bottom
R17  61.74,13.47 90 bottom
R18  62.12,11.94 0 bottom
R19  22.75,39.5 0 top
R20  34.65,43.69 90 top
R21  33.62,43.69 90 top
R22  39.07,42.21 180 top
R23  20.59,46.87 0 top
R24  50.84,41.44 270 top
R25  20.59,44.96 0 top
R27  50.58,31.29 180 bottom
R28  50.57,30.23 180 bottom
R29  49.14,44.53 0 top
S1  2.52,6.01 270 top
SV2  41.16,5.21 180 top
SYS  24.65,2.29 180 top
T1  59.13,25.61 270 bottom
T2  36.99,43.81 270 top
T3  50.63,33.44 0 bottom
U1  38.24,23.5 0 top
U4  10.9,21.15 180 top
U5  54.75,8.13 180 bottom
U6  41.82,42.37 0 top
U7  55.47,42.52 270 top
U$1  14.75,6.36 0 top
USB  2.27,21.26 270 top
WLAN  22.47,2.29 180 top
X1  3.19,41.41 270 top

### Tracks (layer width: path | path; a pad name or v marks a point on that pad's centre or on a via)
+3V3  (via drill 0.33, 0.6)  (1 unrouted)
  Top 0.254: U1.24 59.82,15.87 59.45,15.5 59.45,16.26 | U1.23 60.34,18.42 v61.48,17.28 | U6.8 39.52,42.37 R22.1
  Top 0.305: U7.14 60.15,44.65 C12.2 | R11.2 11.17,7.5 12.56,6.1 19.28,6.1 | 41.04,44.71 41.07,44.71 U6.8 | v48.28,46.11 48.68,46.11 R29.1 | v30.75,19.56 20.34,19.56 20.34,7.16 19.28,6.1 | 19.28,6.1 19.28,4.55 R12.1
  Top 0.406: C11.2 41.04,45.32 | 41.04,45.32 41.04,44.71 | C12.2 60.22,46.11 v48.28,46.11 41.04,46.11 41.04,45.32
  Top 0.61: U1.23 U1.24 | 59.82,15.87 64.91,15.87 C19.1 64.91,14.69 C17.1 | R10.1 R12.1
  Bottom 0.254: v61.48,17.28 62.5,17.28 v62.5,18.29
  Bottom 0.305: 48.26,22.91 30.75,22.91 v30.75,19.56
  Bottom 0.406: 48.28,22.91 v48.28,46.11
  Bottom 0.61: R17.2 61.74,14.41 58.02,14.41 58.02,16.39 L2.P$2 57.93,22.91 48.26,22.91
  pour Bottom (no thermals): 57.04,21.6 57.04,13.34 60.98,13.34 60.98,13.85 63.52,13.85 63.52,21.6
  pour Top (no thermals): 57.55,19.18 67.58,19.18 67.58,14.87 57.55,14.87
+5V  (via drill 0.64, 0.7)
  Top 0.254: U4.4 11.83,20.04 11.83,20.05
  Top 1.016: v11.06,17.79 11.06,17.91 11.83,18.68 11.83,20.05 | C5.1 v10.68,27.94 v10.68,27.95 | 8.91,27.95 v8.78,27.95 8.78,27.48 8.68,27.48 R5.1
  Top 1.524: v10.68,27.95 8.91,27.95
  Bottom 0.813: 35.32,12.91 35.19,12.91
  Bottom 1.016: J3.5 38.37,2.55
  Bottom 1.27: SV2.3 38.37,5.21 38.37,4.96
  Bottom 1.524: 38.37,2.55 38.37,4.96 38.37,5.47 35.19,5.47 35.19,12.91 35.19,14.48 11.06,14.48 v11.06,17.79 8.78,17.79 v8.78,27.95 v10.68,27.95
/RESET
  Bottom 0.305: T1.1 63.94,25.61 ICSP.5
/SPI_OE  (via drill 0.33)
  Top 0.254: 58.38,44.01 U7.13 v56.02,43.95 54.88,45.09 53.86,45.09 53.43,44.65 U7.1 51.01,44.65 v50.82,44.46 | U7.10 58.4,42.04 v56.66,42.04 | v50.82,44.46 49.67,44.46 R29.2 | U7.4 51.6,42.65 50.82,43.44 v50.82,44.46
  Bottom 0.254: v56.66,42.04 56.02,42.68 v56.02,43.95 | T3.1 50.82,34.53 v50.82,44.46
/UART_OE
  Top 0.254: T2.1 38.61,43.09 R22.2 38.62,42.19 38.62,41.41 39.21,40.82 U6.1 41.07,42.33 41.54,42.81 41.54,43.92 U6.7
CTRL_2.0V
  Top 0.305: U1.2 21.61,36.32 21.61,37.6 20.72,38.49 C3.1 | C3.1 18.68,38.49 | X1.7 12.27,39.5 18.3,39.5 18.68,39.12 18.68,38.56 C3.1
  Bottom 0.305: X1.7 12.26,39.58 11.06,40.77 11.06,41.96 X1.4
GND  (via drill 0.33)
  Top 0.254: R20.1 34.73,43.16 T2.3
  Top 1.016: X1.9 12.27,36.96 17.16,36.96
  Bottom 0.254: R27.1 50.12,32.4 T3.3
  Bottom 0.305: C14.2 62.63,10.88 R16.1 | R4.2 57.79,26.24 T1.2
  Bottom 0.762: U5.4 56.4,11.94 U5.9
  Bottom 0.813: USB.4 4.98,14.91 v8.98,14.91
  other vias: 45.43,33.45 13.81,17.32 14.06,19.73 9.11,12.11 11.9,11.86 13.43,10.08 18.25,8.56 22.95,8.69 2.63,5.89 5.17,5 8.22,3.61 10.76,2.97 26.38,28.37 19.39,33.07 20.28,29.01 20.03,25.2 19.65,21.77 30.57,28.24 34.63,28.24 27.52,33.45 30.7,32.94 34,32.82 37.68,33.96 42.76,20.62 34.89,21.26 42.64,25.07 45.56,27.99 50.26,26.08 63.97,40.94 60.67,39.04 52.29,38.66 46.7,41.71 46.32,39.29 30.06,44.25 22.7,43.74 17.49,48.31 50,21.26 53.43,21.26 47.72,16.81 66.77,20.75 62.07,22.91 56.35,31.93 59.02,35.36 35.78,46.02 35.52,41.71 31.59,42.21 32.86,40.18 39.59,46.91 36.29,32.05 41.37,33.2 39.08,31.04 34.76,25.58 10.89,23.54 12.16,24.05 16.6,44.37 24.86,42.72 28.41,27.1 26,38.91 19.9,31.29 16.35,38.4 16.35,37.01 19.9,26.85 12.54,26.34 9.11,10.21 11.27,4.24 28.67,5 32.22,5 66.51,10.34 67.78,12.37 55.59,33.07 52.92,33.96 31.84,45.13 25.74,47.8
  pour Bottom (isolate 0.406, rank 2): 1.16,52.71 70.63,52.71 70.63,0.64 2.16,0.64 arc-90 1.16,1.64
  pour Top (isolate 0.406, rank 2): 1.16,52.71 70.5,52.71 70.5,1.39 arc-90 70.77,0.39 2.29,0.39 arc-90 1.16,1.64
GPIO18
  Top 0.254: U7.9 58.36,41.28 57.55,41.28 56.91,40.65 56.91,39.25 58.05,38.11 59.45,38.11 61.86,35.69 61.86,32.26 60.72,31.12 U1.18
GPIO19  (via drill 0.33)
  Top 0.254: U1.19 50.56,28.58 v49.93,29.22
  Bottom 0.254: v49.93,29.22 49.93,30.05 R28.1
GPIO20  (via drill 0.33)
  Top 0.305: U1.20 56.91,26.04 v55.77,27.18
  Bottom 0.305: v55.77,27.18 R3.2
GPIO21
  Top 0.254: U7.12 56.53,43.31 55.64,42.42 55.64,39.5 57.29,37.85 U1.16
GPIO22
  Top 0.254: U7.6 54.04,41.35 55.01,40.39 55.01,39.25 56.02,38.23 56.02,34.55 56.91,33.66 U1.17
GPIO23  (via drill 0.33)
  Top 0.254: U7.2 v54.11,43.95 v54.12,43.95 | v53.48,24.9 53.48,24.39 54.24,23.63 59.69,23.63 U1.21
  Bottom 0.254: v54.12,43.95 54.12,25.53 v53.48,24.9
GPIO24
  Top 0.254: U1.3 24.27,32.26 25.92,30.61 36.59,30.61 40.91,34.93 40.91,37.47 38.5,39.88 35.32,39.88 33.54,41.66 33.54,43.16 R21.1
GPIO28  (via drill 0.33)
  Top 0.254: R14.1 28.07,6.86 37.99,6.86 38.69,7.56 v38.88,7.75 | U1.27 54.63,10.94 54.63,12.71 53.61,13.72 49.16,13.72 48.66,13.21 48.66,9.02 v47.77,8.13
  Bottom 0.254: v47.77,8.13 45.23,8.13 44.59,8.77 39.89,8.77 v38.88,7.75
JUMPSTART  (via drill 0.33)
  Top 0.254: U1.37 v29.35,12.71 | v9.08,8.52 9.08,7.63 R11.1 C9.1
  Top 0.305: S1.1 4.3,6.48 C9.1
  Top 0.406: v29.36,12.7 v29.35,12.71
  Bottom 0.254: v29.35,12.71 18.41,12.71 14.26,8.57 9.13,8.57 v9.08,8.52
LED_P0  (via drill 0.33)
  Top 0.254: U1.31 44.59,10.86 44.56,10.9 44.59,10.9 v44.59,13.72 | v38.37,13.09 38.37,9.79 37.35,8.77 25.16,8.77
  Top 0.305: 44.6,10.93 44.56,10.9 | 25.16,8.77 21.35,4.96 21.35,2.17 20.72,1.53 20.34,1.53 20.32,1.54 LAN.C
  Bottom 0.254: v44.59,13.72 43.58,14.74 40.02,14.74 v38.37,13.09
LED_WLAN  (via drill 0.33)
  Top 0.254: v47.14,12.57 U1.30
  Top 0.305: v47.14,12.57 v47.13,12.58 | v37.48,7.75 25.54,7.75 23.38,5.59 R13.1
  Bottom 0.305: v47.13,12.58 42.18,12.58 37.48,7.88 v37.48,7.75
MISO
  Top 0.254: ICSP.1 63.64,29.98 55.26,29.98 50.82,34.42 50.82,40.27 50.84,40.29 R24.2
MOSI
  Top 0.254: U7.11 58.46,42.68 59.96,42.68 63.9,38.74 63.9,34.42 65.42,32.9 66.31,32.9 67.96,31.25 67.96,29.22 ICSP.4
N$1
  Bottom 0.305: T1.3 57.45,24.66 R4.1 R3.1
N$2
  Top 1.016: USB.1 5.17,24.95 R5.2
N$3
  Top 1.016: X1.10 9.16,35.12 POE_EN.2
N$4
  Top 0.406: R10.2 17.41,3.5 PWR.A
N$6
  Top 0.406: R12.2 20.29,3.08 LAN.A
N$8
  Top 0.254: R13.2 22.46,3.05
  Top 0.305: 22.46,3.05 WLAN.A
N$9
  Top 0.254: R14.2 24.74,3.13 SYS.A
N$10  (via drill 0.33, 0.6)
  Top 0.254: v51.7,8.64 v63.64,8.64
  Bottom 0.254: U5.2 52.47,9.4 v51.7,8.64 | v63.64,8.64 62.7,8.64 R15.2
  Bottom 0.305: C10.2 50.18,9.28 50.18,9.45
  Bottom 0.762: 49.8,9.45 50.18,9.45 53.49,9.45 U5.2
  Bottom 1.016: L1.2 47.85,9.96 48.53,9.28 49.68,9.28 C10.2
N$11
  Top 0.254: T2.2 34.95,44.46 R20.2 R21.2
N$12
  Bottom 0.254: T3.2 51.04,32.3 R27.2 51.04,30.25 R28.2
N$13
  Bottom 0.305: U5.7 60.47,9.4 61.1,8.77 R15.1
N$14
  Bottom 0.305: U5.5 R18.2 61.74,12.02 R17.1
N$15
  Bottom 0.305: U5.8 59.68,7.75 C13.1
N$16
  Top 0.254: U6.5 42.6,43.95 R2.1
N$17
  Bottom 0.305: U5.6 61.41,10.67 C14.1
  Bottom 0.406: C14.1 C15.1
N$18
  Bottom 0.305: C15.2 62.63,9.96 R16.2
N$19
  Top 0.254: R24.1 50.95,42 U7.5
N$20
  Bottom 0.254: C16.1 53.53,6.99 U5.1
N$21  (via drill 0.33)
  Top 0.254: v52.09,6.36 52.09,6.48 50.43,8.13 50.43,9.02 50.94,9.53 v50.94,12.83
  Bottom 0.254: U5.3 52.85,10.67 | v52.09,6.36 52.42,6.03 C16.2 | 50.94,12.58 v50.94,12.83
  pour Bottom (no thermals): 51.7,10.93 53.86,10.93 53.86,10.42 49.29,10.42 49.29,19.95 55.39,19.95 55.39,13.6 51.7,13.47
N$25
  Bottom 0.254: X1.8 13.34,38.22 14.37,39.25 14.37,41.41 13.73,42.04 12.27,42.04 X1.5
N$32  (via drill 0.33)  (1 unrouted)
  Top 0.203: R19.1 22.16,39.38 v21.61,39.38 | v21.61,41.92 21.61,41.54 C1.1 | 21.73,41.54 R1.1
  Bottom 0.203: v21.61,41.92 v21.61,39.38
N$33  (via drill 0.33)
  Top 0.254: R23.1 19.88,47.12 v19.57,47.12 | v19.57,44.33 20.13,44.89 R25.1 C2.1
  Bottom 0.254: v19.57,47.12 v19.57,44.33
P0_RX_N
  Top 0.203: R25.2 21.05,45.73 21.22,45.73
  Top 0.254: U1.8 37.99,37.22 37.99,37.75 37.38,38.36 32.17,38.36 24.8,45.73 21.22,45.73 16.29,45.73 13.37,48.65 9.77,48.65 7.51,46.38 7.51,42.17 8.91,40.77 9.71,40.77 X1.6
P0_RX_P
  Top 0.254: U1.9 38.5,37.22 38.5,37.96 37.59,38.87 32.38,38.87 25.01,46.23 21.05,46.23 | 21.05,46.23 16.5,46.23 13.58,49.16 9.56,49.16 7,46.59 7,41.79 9.29,39.5 10.3,39.5 11.06,40.27 11.06,43.4 X1.3 | R23.2 21.05,46.23
P0_TX_N
  Top 0.203: 21.05,40.32 21.1,40.32 | R19.2 23.38,39.68 23.38,40.32
  Top 0.254: X1.2 13.76,45.84 14.75,44.86 14.75,42.77 17.2,40.32 21.1,40.32 23.38,40.32 28.13,40.32 30.1,38.34 29.35,37.6 U1.5
P0_TX_P
  Top 0.203: 21.05,40.72 21.1,40.72 | R1.2 23.38,41.36 23.38,40.72
  Top 0.254: U1.6 31.89,37.12 28.29,40.72 23.38,40.72 21.1,40.72 17.37,40.72 15.26,42.84 15.26,45.07 13.19,47.13 X1.1
POE_VIN
  Bottom 1.016: POE_EN.1 11.7,33.66 13.22,35.19 22.65,35.19
  Bottom 1.27: 22.65,35.19 D2.A
RX  (via drill 0.33)
  Top 0.254: R2.2 v45.48,43.95
  Bottom 0.254: J2.2 59.83,49.16 48.66,49.16 45.74,46.23 45.74,44.2 v45.48,43.95
SCK
  Top 0.254: U7.8 61.09,40.65 63.39,38.36 63.39,34.17 65.42,32.14 65.42,29.22 ICSP.3
TX  (via drill 0.33)
  Top 0.254: U6.6 42.05,43.9 42.05,42.81 42.69,42.17 v44.59,42.17
  Bottom 0.254: J2.1 64.02,51.57 63.13,52.46 45.1,52.46 44.21,51.57 44.21,42.55 v44.59,42.17
UART_RX
  Top 0.254: U6.3 42.07,40 43.7,38.36 43.7,30.49 39.64,26.42 39.64,10.94 U1.33
UART_TX
  Top 0.254: 36.97,10.67 U1.34 36.97,26.3 43.07,32.39 43.07,37.85 41.54,39.38 41.54,40.8 U6.2
USB_N
  Top 0.254: 9.67,21.44 12.99,21.44 13.73,22.18 13.73,22.21 13.73,22.74 13.73,31.99 14.26,32.52 15.38,32.52 16.41,33.55 | 9.67,21.44 5.76,21.44 4.97,22.23 4.98,22.24 USB.2 | U4.2 9.67,22.3 9.67,21.44
  Top 0.305: 16.41,33.55 16.55,33.55 U1.50
USB_P
  Top 0.254: 9.92,20.96 13.2,20.96 14.24,22 14.24,31.78 14.47,32.01 15.38,32.01 16.39,31.01 | 9.92,20.96 5.68,20.96 USB.3 | U4.3 9.9,20.94 9.92,20.96
  Top 0.305: 16.39,31.01 16.55,31.01 U1.49
VCC
  Bottom 1.016: SV2.2 41.16,7.12 41.93,7.88 44.08,7.88 44.85,7.12 45.82,7.12 46.75,6.18 L1.1
VIN  (via drill 0.56)
  Top 0.813: v42.81,16.77 43.32,16.77 43.32,6.36 43.7,6.36 SV2.1 46.24,5.21 J3.8
  Bottom 0.813: v42.81,16.77 26.91,16.77 D2.C

### Text on the board
tPlace: 13 | 12 | 11 | 10 | 9 | 8 | 7 | 6 | 5 | 4 | 3 | 2 | 1 | 0
tNames: DIGITAL | GND | AREF | RX | TX | 1 | VCC | 5V | VIN | A3 | A4 | A5 | IOREF | RST | 3V3 | A0 | A1 | A2 | 5V | GND | VIN
ReferenceLC: X2
tDocu: YUN SHIELD V1.1.6